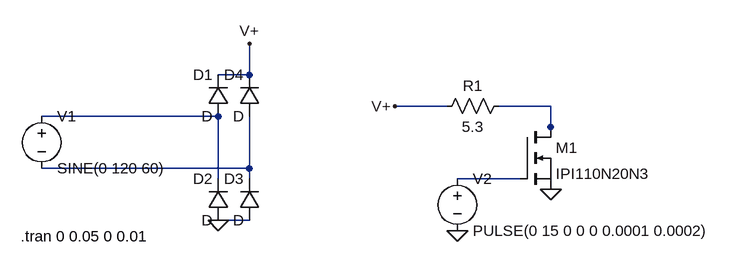
[diagram p0: schematic MotorPWM.asc]
MotorPWM.asc, the LTspice schematic file:
Version 4
SHEET 1 1044 680
WIRE 224 80 224 32
WIRE 224 80 176 80
WIRE 528 128 448 128
WIRE 688 128 608 128
WIRE 176 144 -96 144
WIRE 688 160 688 128
WIRE 688 176 688 160
WIRE 224 224 224 144
WIRE 224 224 -96 224
WIRE 176 240 176 144
WIRE 224 240 224 224
WIRE 640 240 544 240
WIRE 224 304 176 304
FLAG 176 304 0
FLAG 224 32 V+
FLAG 448 128 V+
FLAG 688 256 0
FLAG 544 320 0
SYMBOL diode 192 144 R180
WINDOW 0 24 64 Left 2
WINDOW 3 24 0 Left 2
SYMATTR InstName D1
SYMBOL diode 192 304 R180
WINDOW 0 24 64 Left 2
WINDOW 3 24 0 Left 2
SYMATTR InstName D2
SYMBOL diode 240 304 R180
WINDOW 0 24 64 Left 2
WINDOW 3 24 0 Left 2
SYMATTR InstName D3
SYMBOL diode 240 144 R180
WINDOW 0 24 64 Left 2
WINDOW 3 24 0 Left 2
SYMATTR InstName D4
SYMBOL voltage -96 128 R0
WINDOW 123 0 0 Left 0
WINDOW 39 0 0 Left 0
SYMATTR InstName V1
SYMATTR Value SINE(0 120 60)
SYMBOL nmos 640 160 R0
SYMATTR InstName M1
SYMATTR Value IPI110N20N3
SYMBOL voltage 544 224 R0
WINDOW 123 0 0 Left 0
WINDOW 39 0 0 Left 0
SYMATTR InstName V2
SYMATTR Value PULSE(0 15 0 0 0 0.0001 0.0002)
SYMBOL res 624 112 R90
WINDOW 0 0 56 VBottom 2
WINDOW 3 32 56 VTop 2
SYMATTR InstName R1
SYMATTR Value 5.3
TEXT -128 328 Left 2 !.tran 0 0.05 0 0.01

The netlist it stands for:
* MotorPWM.asc
D1 N002 V+ D
D2 0 N002 D
D3 0 N003 D
D4 N003 V+ D
V1 N002 N003 SINE(0 120 60)
M1 N001 N004 0 0 IPI110N20N3
V2 N004 0 PULSE(0 15 0 0 0 0.0001 0.0002)
R1 N001 V+ 5.3
.model D D
.lib standard.dio
.model NMOS NMOS
.model PMOS PMOS
.lib standard.mos
.tran 0 0.05 0 0.01
.backanno
.end